# EAGLE design relay-board (EAGLE 5.08)
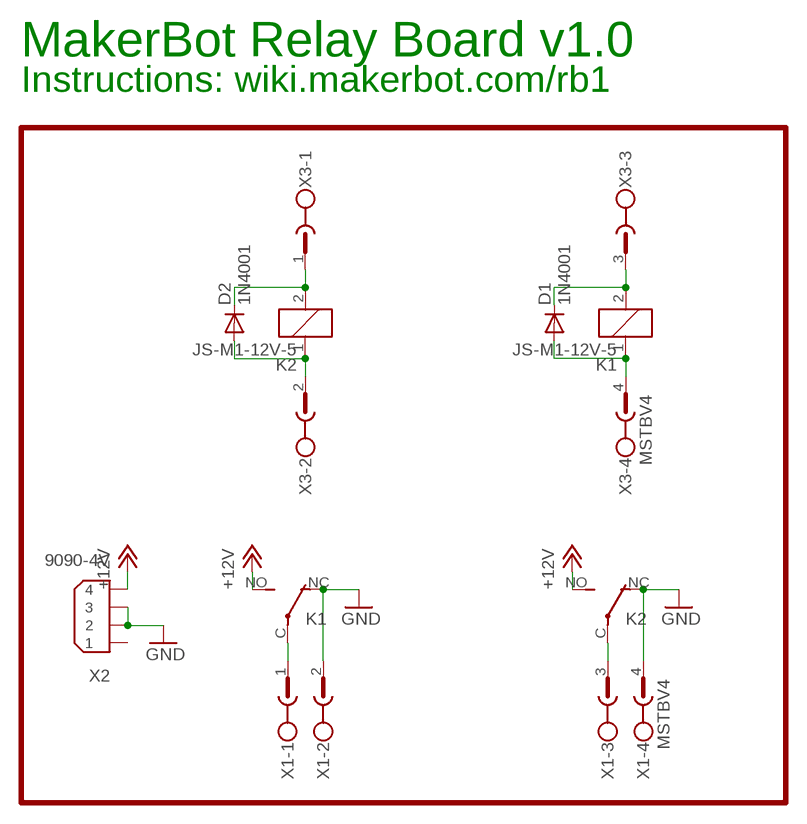
[diagram p0: schematic, sheet 1]

## Parts
D1  1N4001  DIODEPTH  [DIODE-1N4001]
D2  1N4001  DIODEPTH  [DIODE-1N4001]
K1  JS-M1-12V-5  [JS-M]
K2  JS-M1-12V-5  [JS-M]
X1  MSTBV4  [MSTBV4]
X2  9090-4V  [9090-4V]
X3  MSTBV4  [MSTBV4]

## Nets
+12V: K1.NO(2:S) K2.NO(2:S) X2.4
GND: K1.NC(2:O) K2.NC(2:O) X1.2 X1.4 X2.2 X2.3
N$1: D2.C K2.2 X3.1
N$2: K1.C(2:P) X1.1
N$3: K2.C(2:P) X1.3
N$4: D2.A K2.1 X3.2
N$5: D1.A K1.1 X3.4
N$6: D1.C K1.2 X3.3
Unconnected: X2.1

## Notes on the sheet
- MakerBot Relay Board v1.0
- Instructions: wiki.makerbot.com/rb1

## Library data of the parts
D1 D2 = SparkFun:DIODE: Diode These are standard reverse protection diodes and small signal diodes. SMA package can handle up to about 1A. SOD-323 can handle about 200mA. What the SOD-323 package when ordering, there are some mfgs out there that are 5-pin packages.
K1 K2 = relay:JS-M1*: Automotive Ultra-Miniature Power Relay NAiS Source: http://www.mew-europe.com/.. en_ds_61211_0000.pdf
X1 X3 = con-phoenix-508:MSTBV4: PHOENIX
X2 = con-thomas-betts:9090-4: Disk Drive Power four position Source: Thomas & Betts Electronic Interconnects Eiropean Edition 1998

## Board
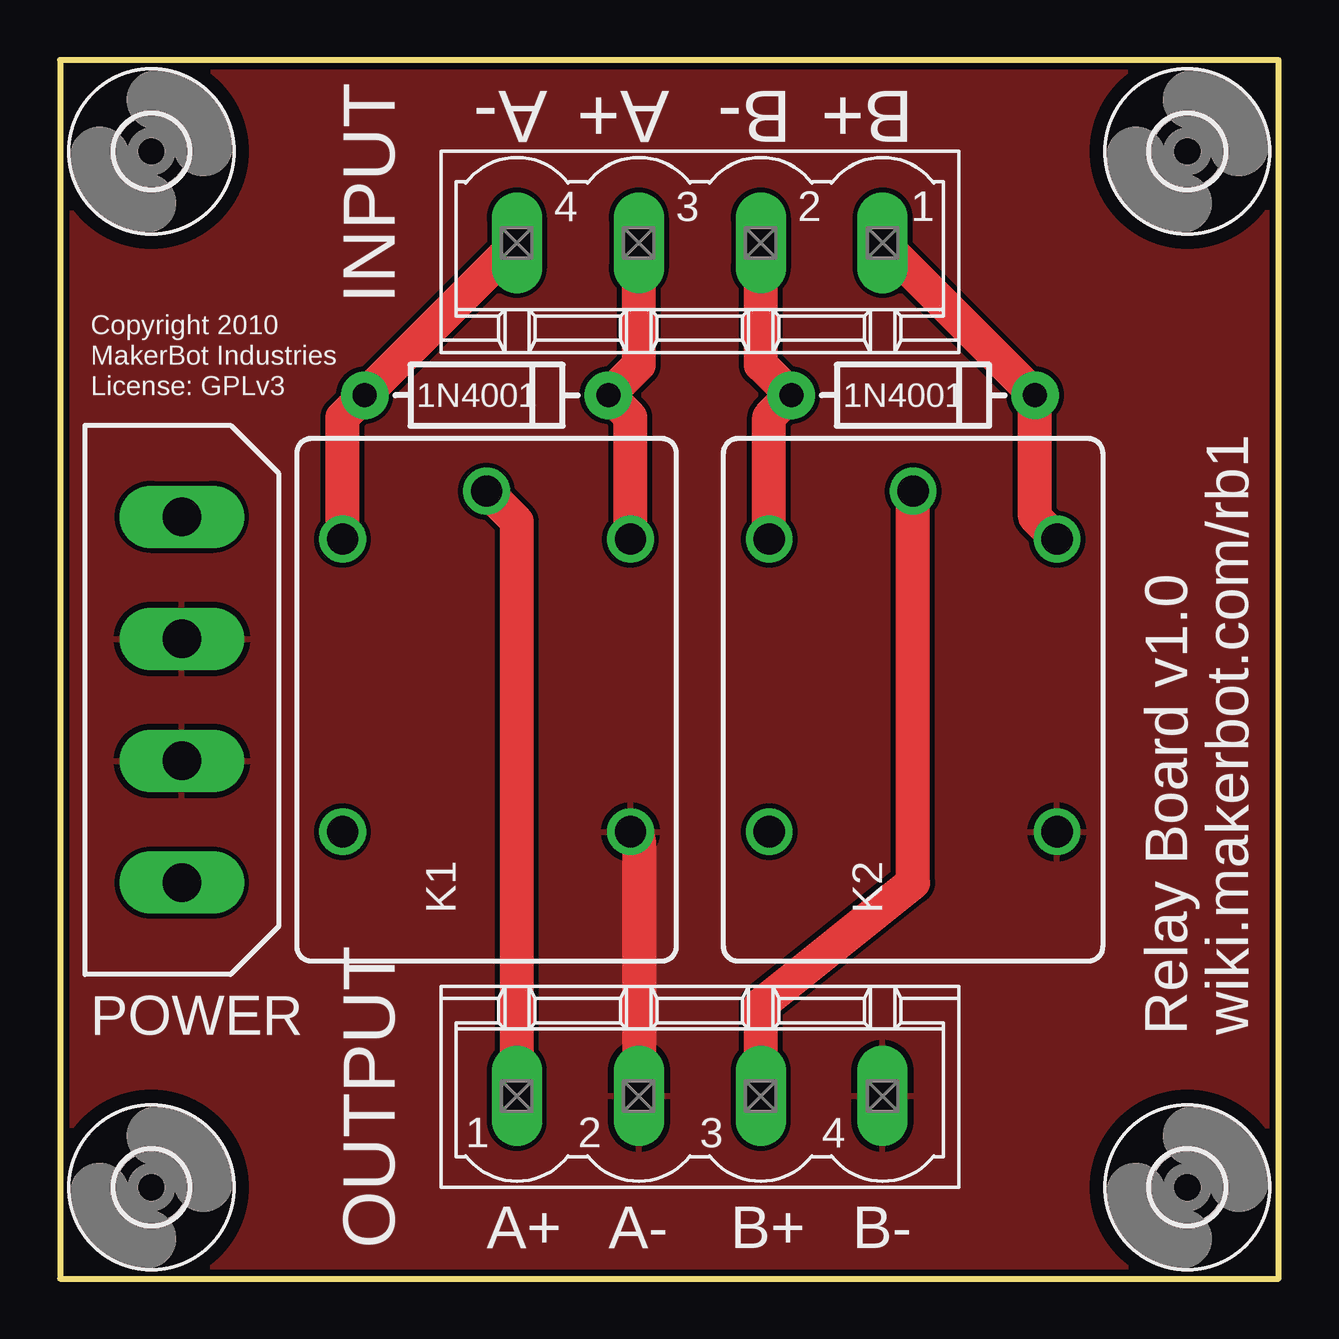
[diagram p1: board, top side]
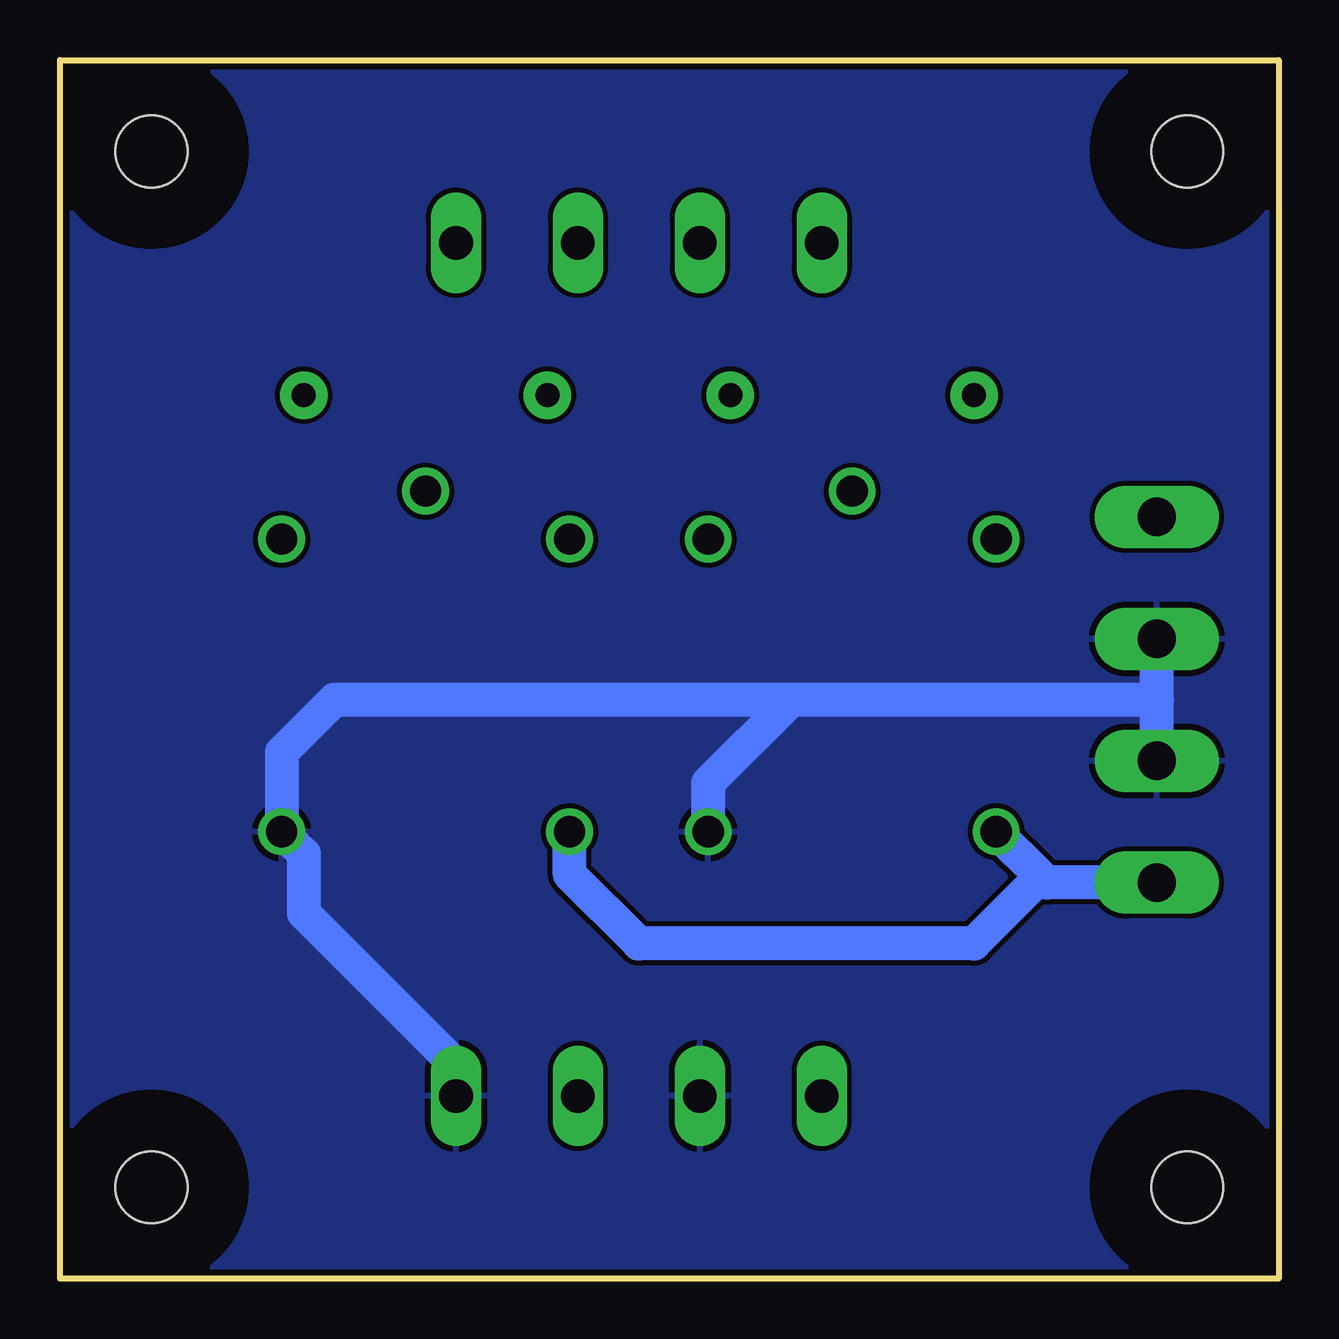
[diagram p2: board, bottom side, seen from below]

Size 50.8 x 50.8 mm. Coordinates in mm from the lower left corner, seen from the top.
Outline: 0,0 50.8,0 50.8,50.8 0,50.8 0,0
Copper layers (1*16): Top 0.035mm / dielectric 1.5mm / Bottom 0.035mm
Design rules "SparkFun": minimum track width 8mil, minimum drill 20mil, track to track 8mil, track to pad 8mil, pad to pad 8mil, via to via 8mil, smd to smd 8mil, copper to edge 10mil, drill to drill 8mil, minimum pad ring 12mil, minimum via ring 10mil, stop-mask expansion 4mil, vias tented up to drill 25mil, thermal gap 10mil

### Footprints (pad centres in the part's own frame; a part is rotated, then mirrored left to right if it is on the bottom)
DIODE-1N4001 = drill 1 pad 1.981 round: A -5.08,0; C 5.08,0
JS-M = drill 1.3 round: 1 6.7,6; 2 6.7,-6; C 8.7,0; NC -5.5,-6; NO -5.5,6
3,0 = hole 3: 0,0
MSTBV4 = drill 1.397 long: 1 -7.62,0; 2 -2.54,0; 3 2.54,0; 4 7.62,0
9090-4V = drill 1.6 pad 2.6 long: 1 -7.62,0; 2 -2.54,0; 3 2.54,0; 4 7.62,0

### Placement (x,y rotation side)
D1  17.78,36.83 0 top
D2  35.56,36.83 0 top
K1  17.78,24.13 90 top
K2  35.56,24.13 90 top
U$1  [3,0]  3.81,3.81 0 top
U$2  [3,0]  46.99,3.81 0 top
U$3  [3,0]  46.99,46.99 0 top
U$4  [3,0]  3.81,46.99 0 top
X1  26.67,7.62 0 top
X2  5.08,24.13 270 top
X3  26.67,43.18 180 top

### Tracks (layer width: path | path; a pad name or v marks a point on that pad's centre or on a via)
+12V
  Bottom 1.422: X2.4 9.66,16.51 9.91,16.76 | 9.91,16.76 K1.NO | K2.NO 29.56,16.86 26.67,13.97 12.7,13.97 9.91,16.76
GND
  Top 1.422: X1.2 24.13,18.28 K1.NC
  Bottom 1.422: X2.3 5.08,24.13 | 5.08,24.13 X2.2 | K1.NC 23.78,20.67 20.32,24.13 | 5.08,24.13 20.32,24.13 | 20.32,24.13 39.37,24.13 41.56,21.94 K2.NC 40.64,17.71 40.64,15.24 34.29,8.89 X1.4
  pour Top: 0,50.8 50.8,50.8 50.8,0 0,0
  pour Bottom: 0,50.8 50.8,50.8 50.8,0 0,0
N$1
  Top 1.422: X3.1 D2.C 40.64,31.75 K2.2
N$2
  Top 1.422: X1.1 19.05,31.56 K1.C
N$3
  Top 1.422: X1.3 29.21,11.43 35.56,16.51 K2.C
N$4
  Top 1.422: K2.1 29.56,35.91 D2.A 29.21,38.1 X3.2
N$5
  Top 1.422: K1.1 11.78,35.91 D1.A X3.4
N$6
  Top 1.422: K1.2 23.78,35.91 D1.C 24.13,38.1 X3.3

### Text on the board
tPlace: A- | A+ | B- | B+ | INPUT | Copyright 2010 | MakerBot Industries | License: GPLv3 | POWER | Relay Board v1.0 | wiki.makerbot.com/rb1 | OUTPUT | A+ | A- | B+ | B-